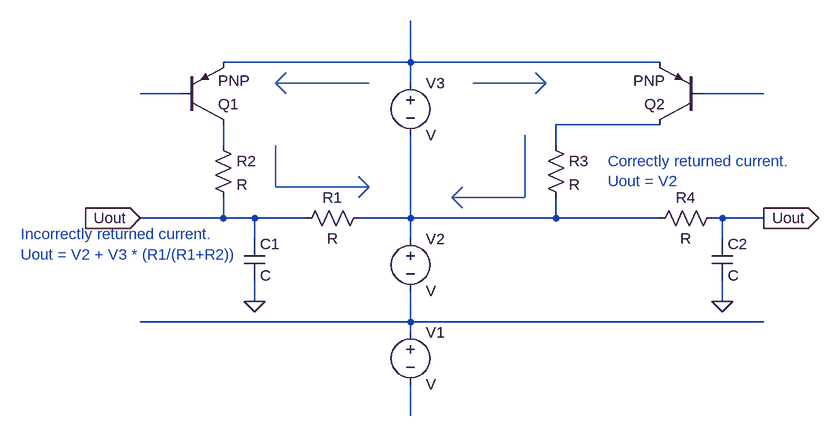
[diagram p0: schematic ltc6803_passive_discharge_returnpathfail.asc]
ltc6803_passive_discharge_returnpathfail.asc, the LTspice schematic file:
Version 4
SHEET 1 880 680
WIRE 128 -128 128 -192
WIRE 128 -128 -160 -128
WIRE 512 -128 128 -128
WIRE 128 -96 128 -128
WIRE -224 -80 -288 -80
WIRE 672 -80 576 -80
WIRE 512 -32 352 -32
WIRE -160 0 -160 -32
WIRE 352 0 352 -32
WIRE -160 112 -160 80
WIRE -160 112 -288 112
WIRE -112 112 -160 112
WIRE -32 112 -112 112
WIRE 128 112 128 -16
WIRE 128 112 48 112
WIRE 352 112 352 80
WIRE 352 112 128 112
WIRE 512 112 352 112
WIRE 608 112 592 112
WIRE 672 112 608 112
WIRE -112 144 -112 112
WIRE 128 144 128 112
WIRE 608 144 608 112
WIRE -112 240 -112 208
WIRE 608 240 608 208
WIRE 128 272 128 224
WIRE 128 272 -288 272
WIRE 672 272 128 272
WIRE 128 288 128 272
WIRE 128 416 128 368
FLAG -112 240 0
FLAG 608 240 0
FLAG -288 112 Uout
IOPIN -288 112 In
FLAG 672 112 Uout
IOPIN 672 112 Out
SYMBOL voltage 128 272 R0
SYMATTR InstName V1
SYMBOL voltage 128 128 R0
SYMATTR InstName V2
SYMBOL voltage 128 -112 R0
SYMATTR InstName V3
SYMBOL res 64 96 R90
WINDOW 0 0 56 VBottom 2
WINDOW 3 32 56 VTop 2
SYMATTR InstName R1
SYMBOL cap -128 144 R0
SYMATTR InstName C1
SYMBOL pnp -224 -32 M180
SYMATTR InstName Q1
SYMBOL res -176 -16 R0
SYMATTR InstName R2
SYMBOL pnp 576 -32 R180
SYMATTR InstName Q2
SYMBOL res 336 -16 R0
SYMATTR InstName R3
SYMBOL res 608 96 R90
WINDOW 0 0 56 VBottom 2
WINDOW 3 32 56 VTop 2
SYMATTR InstName R4
SYMBOL cap 592 144 R0
SYMATTR InstName C2
TEXT -472 136 Left 2 ;Incorrectly returned current.
TEXT -472 168 Left 2 ;Uout = V2 + V3 * (R1/(R1+R2))
TEXT 432 24 Left 2 ;Correctly returned current.\nUout = V2
LINE Normal -80 -96 64 -96
LINE Normal -64 -112 -80 -96
LINE Normal -64 -80 -80 -96
LINE Normal -80 64 -80 0
LINE Normal 64 64 -80 64
LINE Normal 48 48 64 64
LINE Normal 48 48 48 48
LINE Normal 64 64 48 48
LINE Normal 48 80 64 64
LINE Normal 48 80 48 80
LINE Normal 336 -96 224 -96
LINE Normal 320 -112 336 -96
LINE Normal 320 -112 320 -112
LINE Normal 336 -96 320 -112
LINE Normal 320 -80 336 -96
LINE Normal 320 -80 320 -80
LINE Normal 320 -80 320 -80
LINE Normal 320 -80 320 -80
LINE Normal 304 80 304 -16
LINE Normal 192 80 304 80
LINE Normal 208 64 192 80
LINE Normal 192 80 208 64
LINE Normal 208 96 192 80
LINE Normal 208 96 208 96

The netlist it stands for:
* ltc6803_passive_discharge_returnpathfail.asc
V1 N007 N008 V
V2 N006 N007 V
V3 N001 N006 V
R1 N006 Uout R
C1 Uout 0 C
Q1 N005 N002 N001 0 PNP
R2 N005 Uout R
Q2 N004 N003 N001 0 PNP
R3 N004 N006 R
R4 Uout N006 R
C2 Uout 0 C
.model NPN NPN
.model PNP PNP
.lib standard.bjt
* Incorrectly returned current.
* Uout = V2 + V3 * (R1/(R1+R2))
* Correctly returned current.
* Uout = V2
.backanno
.end